# Altium project TCC_Aquisicao_sinais.PrjPcb
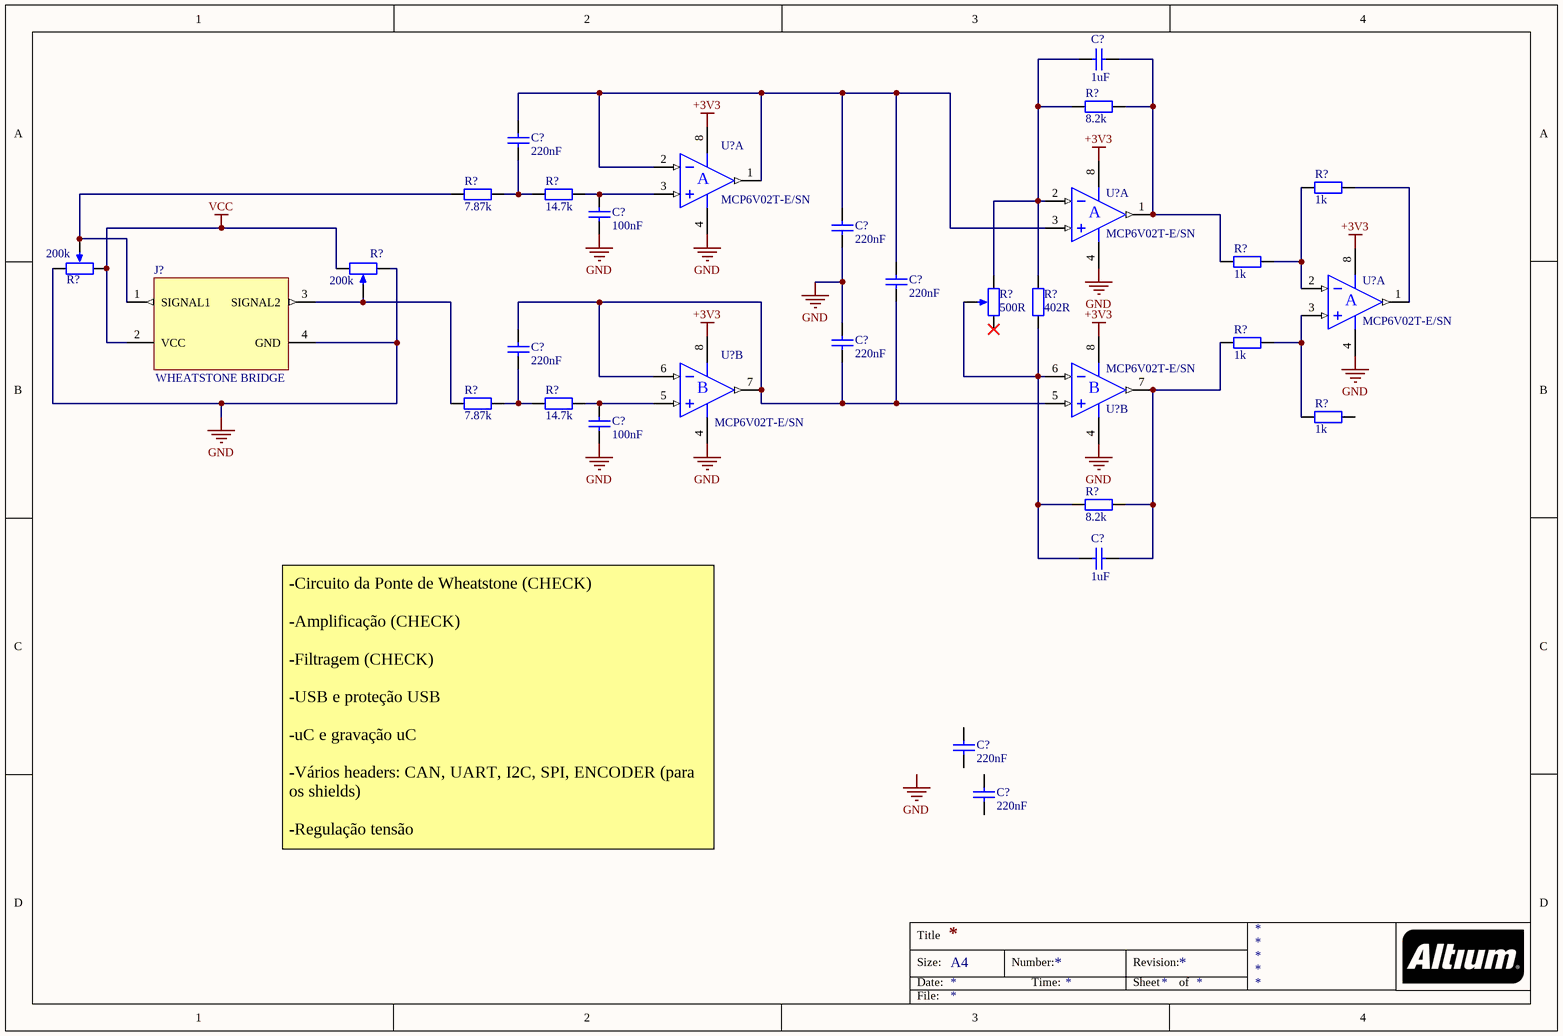
[diagram p0: Sheet1.SchDoc]
1 sheet, 31 parts. Net scope: global (net labels, ports and power ports of the same name join across sheets).
Board file: PCB1.PcbDoc

## Sheet Sheet1.SchDoc
size A4

### Parts
(Parts that share a designator on the sheet are numbered #1, #2 ... from top to bottom, then left to right.)
C?#1  value 1uF  (hidden comment: Capacitor)
C?#2  value 220nF  (hidden comment: Capacitor)
C?#3  value 100nF  (hidden comment: Capacitor)
C?#4  value 220nF  (hidden comment: Capacitor)
C?#5  value 220nF  (hidden comment: Capacitor)
C?#6  value 220nF  (hidden comment: Capacitor)
C?#7  value 220nF  (hidden comment: Capacitor)
C?#8  value 100nF  (hidden comment: Capacitor)
C?#9  value 1uF  (hidden comment: Capacitor)
C?#10  value 220nF  (hidden comment: Capacitor)
C?#11  value 220nF  (hidden comment: Capacitor)
J?  WHEATSTONE BRIDGE
R?#1  value 8.2k  (hidden comment: Resistor)
R?#2  value 1k  (hidden comment: Resistor)
R?#3  value 7.87k  (hidden comment: Resistor)
R?#4  value 14.7k  (hidden comment: Resistor)
R?#5  value 1k  (hidden comment: Resistor)
R?#6  Resistance: 200k  (hidden comment: PVG5A204C03B00)
R?#7  Resistance: 200k  (hidden comment: PVG5A204C03B00)
R?#8  Resistance: 500R  (hidden comment: PVG5A501C03R00)
R?#9  value 402R  (hidden comment: Resistor)
R?#10  value 1k  (hidden comment: Resistor)
R?#11  value 7.87k  (hidden comment: Resistor)
R?#12  value 14.7k  (hidden comment: Resistor)
R?#13  value 1k  (hidden comment: Resistor)
R?#14  value 8.2k  (hidden comment: Resistor)
U?#1  MCP6V02T-E/SN  (part A of 2)
U?#2  MCP6V02T-E/SN  (part A of 2)
U?#3  MCP6V02T-E/SN  (part A of 2)
U?#4  MCP6V02T-E/SN  (part B of 2)
U?#5  MCP6V02T-E/SN  (part B of 2)

### Nets
+3V3: U?#1.8(V+) U?#2.8(V+) U?#3.8(V+) U?#4.8(V+) U?#5.8(V+)
GND: C?#3.1 C?#4.1 C?#6.2 C?#8.1 J?.4(GND) R?#6.2(BOT) R?#7.2(BOT) U?#1.4(V-) U?#2.4(V-) U?#3.4(V-) U?#4.4(V-) U?#5.4(V-)
VCC: J?.2(VCC) R?#6.1(TOP) R?#7.1(TOP)
NetC?#1_1: C?#1.1 R?#1.2 R?#5.1 U?#2.1(OUT)
NetC?#1_2: C?#1.2 R?#1.1 R?#8.1(TOP) R?#9.2 U?#2.2(IN-)
NetC?#2_1: C?#2.1 R?#3.2 R?#4.1
NetC?#2_2: C?#2.2 C?#4.2 C?#5.2 U?#1.1(OUT) U?#1.2(IN-) U?#2.3(IN+)
NetC?#3_2: C?#3.2 R?#4.2 U?#1.3(IN+)
NetC?#5_1: C?#5.1 C?#6.1 C?#7.2 U?#4.6(IN-) U?#4.7(OUT) U?#5.5(IN+)
NetC?#7_1: C?#7.1 R?#11.2 R?#12.1
NetC?#8_2: C?#8.2 R?#12.2 U?#4.5(IN+)
NetC?#9_1: C?#9.1 R?#10.1 R?#14.2 U?#5.7(OUT)
NetC?#9_2: C?#9.2 R?#8.3(TAP) R?#9.1 R?#14.1 U?#5.6(IN-)
NetJ?_1: J?.1(SIGNAL1) R?#3.1 R?#6.3(TAP)
NetJ?_3: J?.3(SIGNAL2) R?#7.3(TAP) R?#11.1
NetR?#2_1: R?#2.1 R?#5.2 U?#3.2(IN-)
NetR?#2_2: R?#2.2 U?#3.1(OUT)
NetR?#10_2: R?#10.2 R?#13.1 U?#3.3(IN+)

Not connected (* = marked no-connect by the designer): C?#10 1 2; C?#11 1 2; R?#8 2(BOT)*; R?#13 2

### Notes on the sheet
- -Circuito da Ponte de Wheatstone (CHECK)
  -Amplificação (CHECK)
  -Filtragem (CHECK)
  -USB e proteção USB
  -uC e gravação uC
  -Vários headers: CAN, UART, I2C, SPI, ENCODER (para os shields)
  -Regulação tensão
- Labels drawn without touching a wire or pin: GND
- Title
- Size:
- Date:
- A4
- Number:
- Time:
- Revision:
- Sheet
- of
- File:
- (in symbol MCP6V02T-E/SN, part A) A
- (in symbol MCP6V02T-E/SN, part B) B

### Library data of the parts
J? = WHEATSTONE BRIDGE: Headers & Wire Housings NANO-FIT HDR SMT VT DLR 4CKT 15AU BLK; Manufacturer: Molex; Manufacturer Part Number: 105429-1204; Supplier 1: Mouser; Stock 1: 868; Pricing 1: 1=2.31000, 10=2.09000, 25=2.09000, 100=1.79000, 300=1.79000, 600=1.76000, 900=1.50000, 2400=1.40000, 4800=1.34000 (USD); RoHS: No; Supplier Part Number 1: 538-105429-1204
R?#6 R?#7 = PVG5A204C03B00: Trimmer Resistors - SMD 200Kohms 5mm 11turn Top Adjust; Manufacturer: Bourns; RoHS: No; ComponentLink1URL: http://www.mouser.com/ds/2/54/vg5-907351.pdf?src-supplier=Mouser; ComponentLink1Description: http://www.mouser.com/ds/2/54/vg5-907351.pdf?src-supplier=Mouser; Supplier 1: Mouser; Stock 1: 402; Pricing 1: 1=2.54000, 10=2.11000, 100=2.04000, 500=1.82000, 1000=1.82000, 2500=1.82000 (USD); Supplier Part Number 1: 81-PVG5A204C03B00
R?#8 = PVG5A501C03R00: Res Cermet Trimmer 500 Ohm 10% 1/4W 11(Elec)Turn 1.5mm (4.8 X 3.9 X 5mm) J-Hook SMD T/R; Manufacturer: Bourns; Number of Turns: 11; Max Power Dissipation: 250mW; Temperature Coefficient: 150ppm/°C; Supplier 1: Mouser; Stock 1: 334; Pricing 1: 1=3.19000, 10=2.51000, 50=2.42000, 100=2.02000, 500=1.86000, 1000=1.58000 (USD); RoHS: Yes; Mount: Surface Mount; Packaging: Cut Tape; Tolerance: 10%; Composition: Cermet; Height: 0.201inch; ComponentLink1URL: http://www.mouser.com/ds/2/54/vg5-907351.pdf?src-supplier=Mouser; ComponentLink1Description: http://www.mouser.com/ds/2/54/vg5-907351.pdf?src-supplier=Mouser; ComponentLink2URL: https://www.bourns.com/docs/Product-Datasheets/pvg5.pdf?src-supplier=Digi-Key; ComponentLink2Description: https://www.bourns.com/docs/Product-Datasheets/pvg5.pdf?src-supplier=Digi-Key; ComponentLink3URL: http://www.bourns.com/docs/Product-Datasheets/pvg5.pdf?src-supplier=Digi-Key; ComponentLink3Description: http://www.bourns.com/docs/Product-Datasheets/pvg5.pdf?src-supplier=Digi-Key; Supplier Part Number 1: 81-PVG5A501C03R00
U?#1-U?#5 = MCP6V02T-E/SN: IC OPAMP CHOPPER 1.3MHZ 8SOIC; Manufacturer: Microchip; Number of Channels: 2; Output Current: 22mA; Slew Rate: 0.5V/µs; Nominal Supply Current: 300uA; Min Supply Voltage: 1.8V; Max Supply Voltage: 5.5V; Voltage Gain: 156dB; Common Mode Rejection Ratio: 130dB; Input Offset Voltage (Vos): 2uV; Input Bias Current: 1pA; Supplier 1: Mouser; Stock 1: 1362; Pricing 1: 1=2.55000, 10=2.55000, 25=2.12000, 100=1.93000, 250=1.93000, 500=1.93000 (USD); RoHS: Yes; Mount: Surface Mount; Case/Package: SOIC; Number of Pins: 8; Min Operating Temperature: -40°C; Max Operating Temperature: 125°C; Packaging: Tape and Reel; Unity Gain Bandwidth Product: 1.3MHz; Package Quantity: 3300; Gain Bandwidth Product: 1.3MHz; Operating Supply Current: 300uA; Number of Circuits: 2; Output Current per Channel: 22mA; Number of Elements: 2; Power Supply Rejection Ratio (PSRR): 130dB; Radiation Hardening: No; Lead Free: Lead Free; ComponentLink1URL: https://datasheet.ciiva.com/11710/22058c-11710950.pdf?src-supplier=Avnet; ComponentLink1Description: https://datasheet.ciiva.com/11710/22058c-11710950.pdf?src-supplier=Avnet; ComponentLink2URL: https://datasheet.ciiva.com/1806/22058c-1806668.pdf?src-supplier=Digi-Key; ComponentLink2Description: https://datasheet.ciiva.com/1806/22058c-1806668.pdf?src-supplier=Digi-Key; ComponentLink3URL: https://datasheet.ciiva.com/16453/filehandler-aspxddocname-en535978-16453870.pdf?src-supplier=Future+Electronics; ComponentLink3Description: https://datasheet.ciiva.com/16453/filehandler-aspxddocname-en535978-16453870.pdf?src-supplier=Future+Electronics; ComponentLink4URL: https://datasheet.ciiva.com/17572/22058c-17572430.pdf?src-supplier=Avnet+Europe; ComponentLink4Description: https://datasheet.ciiva.com/17572/22058c-17572430.pdf?src-supplier=Avnet+Europe; Supplier Part Number 1: 579-MCP6V02T-E/SN
  U?#2 U?#3 U?#5: Manufacturer Part Number: MCP6V02T-E/SN